# Altium schematic sheet XL-1608UBC-041_XL-1608UBC-04.schdoc
size 127 x 101 mm
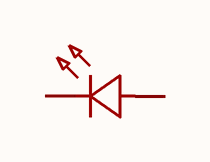
[diagram p0: XL-1608UBC-041_XL-1608UBC-04.schdoc]

## Parts
LED?  XL-1608UBC-04  [LED0603-RD_BLUE]  (value not drawn)

## Nets

Not connected (* = marked no-connect by the designer): LED? 1(K) 2(A)

## Library data of the parts
LED? = XL-1608UBC-04: Manufacturer: XINGLIGHT(成兴光); Add into BOM: yes; Illumination Color: 蓝色; Voltage - Forward(Vf): 3.3V; Power(Watts): 70mW; Forward Current: 20mA; Wavelength - Dominant: 455nm~475nm; Peak Wavelength: 470nm; Lens Color: 无色透明透镜; Luminous Intensity: 300mcd; Viewing Angle: 120°; Symbol: XL-1608UBC-04; Device: XL-1608UBC-04; LCSC Part Name: 0603蓝色贴片式发光二极管; Supplier Part: C965807; Manufacturer Part: XL-1608UBC-04; Supplier Footprint: 0603; JLCPCB Part Class: Extended Part; Datasheet: https://item.szlcsc.com/datasheet/XL-1608UBC-04/1051416.html; Supplier: LCSC; Convert to PCB: yes; Lamp Holder Type: -; Diode Configuration: -; Color Temperature: -; Mounting Style: 正贴; Operating Temperature: -